# Altium schematic sheet main.SchDoc
size 420 x 297 mm; SheetNumber: 1; SheetTotal: 1
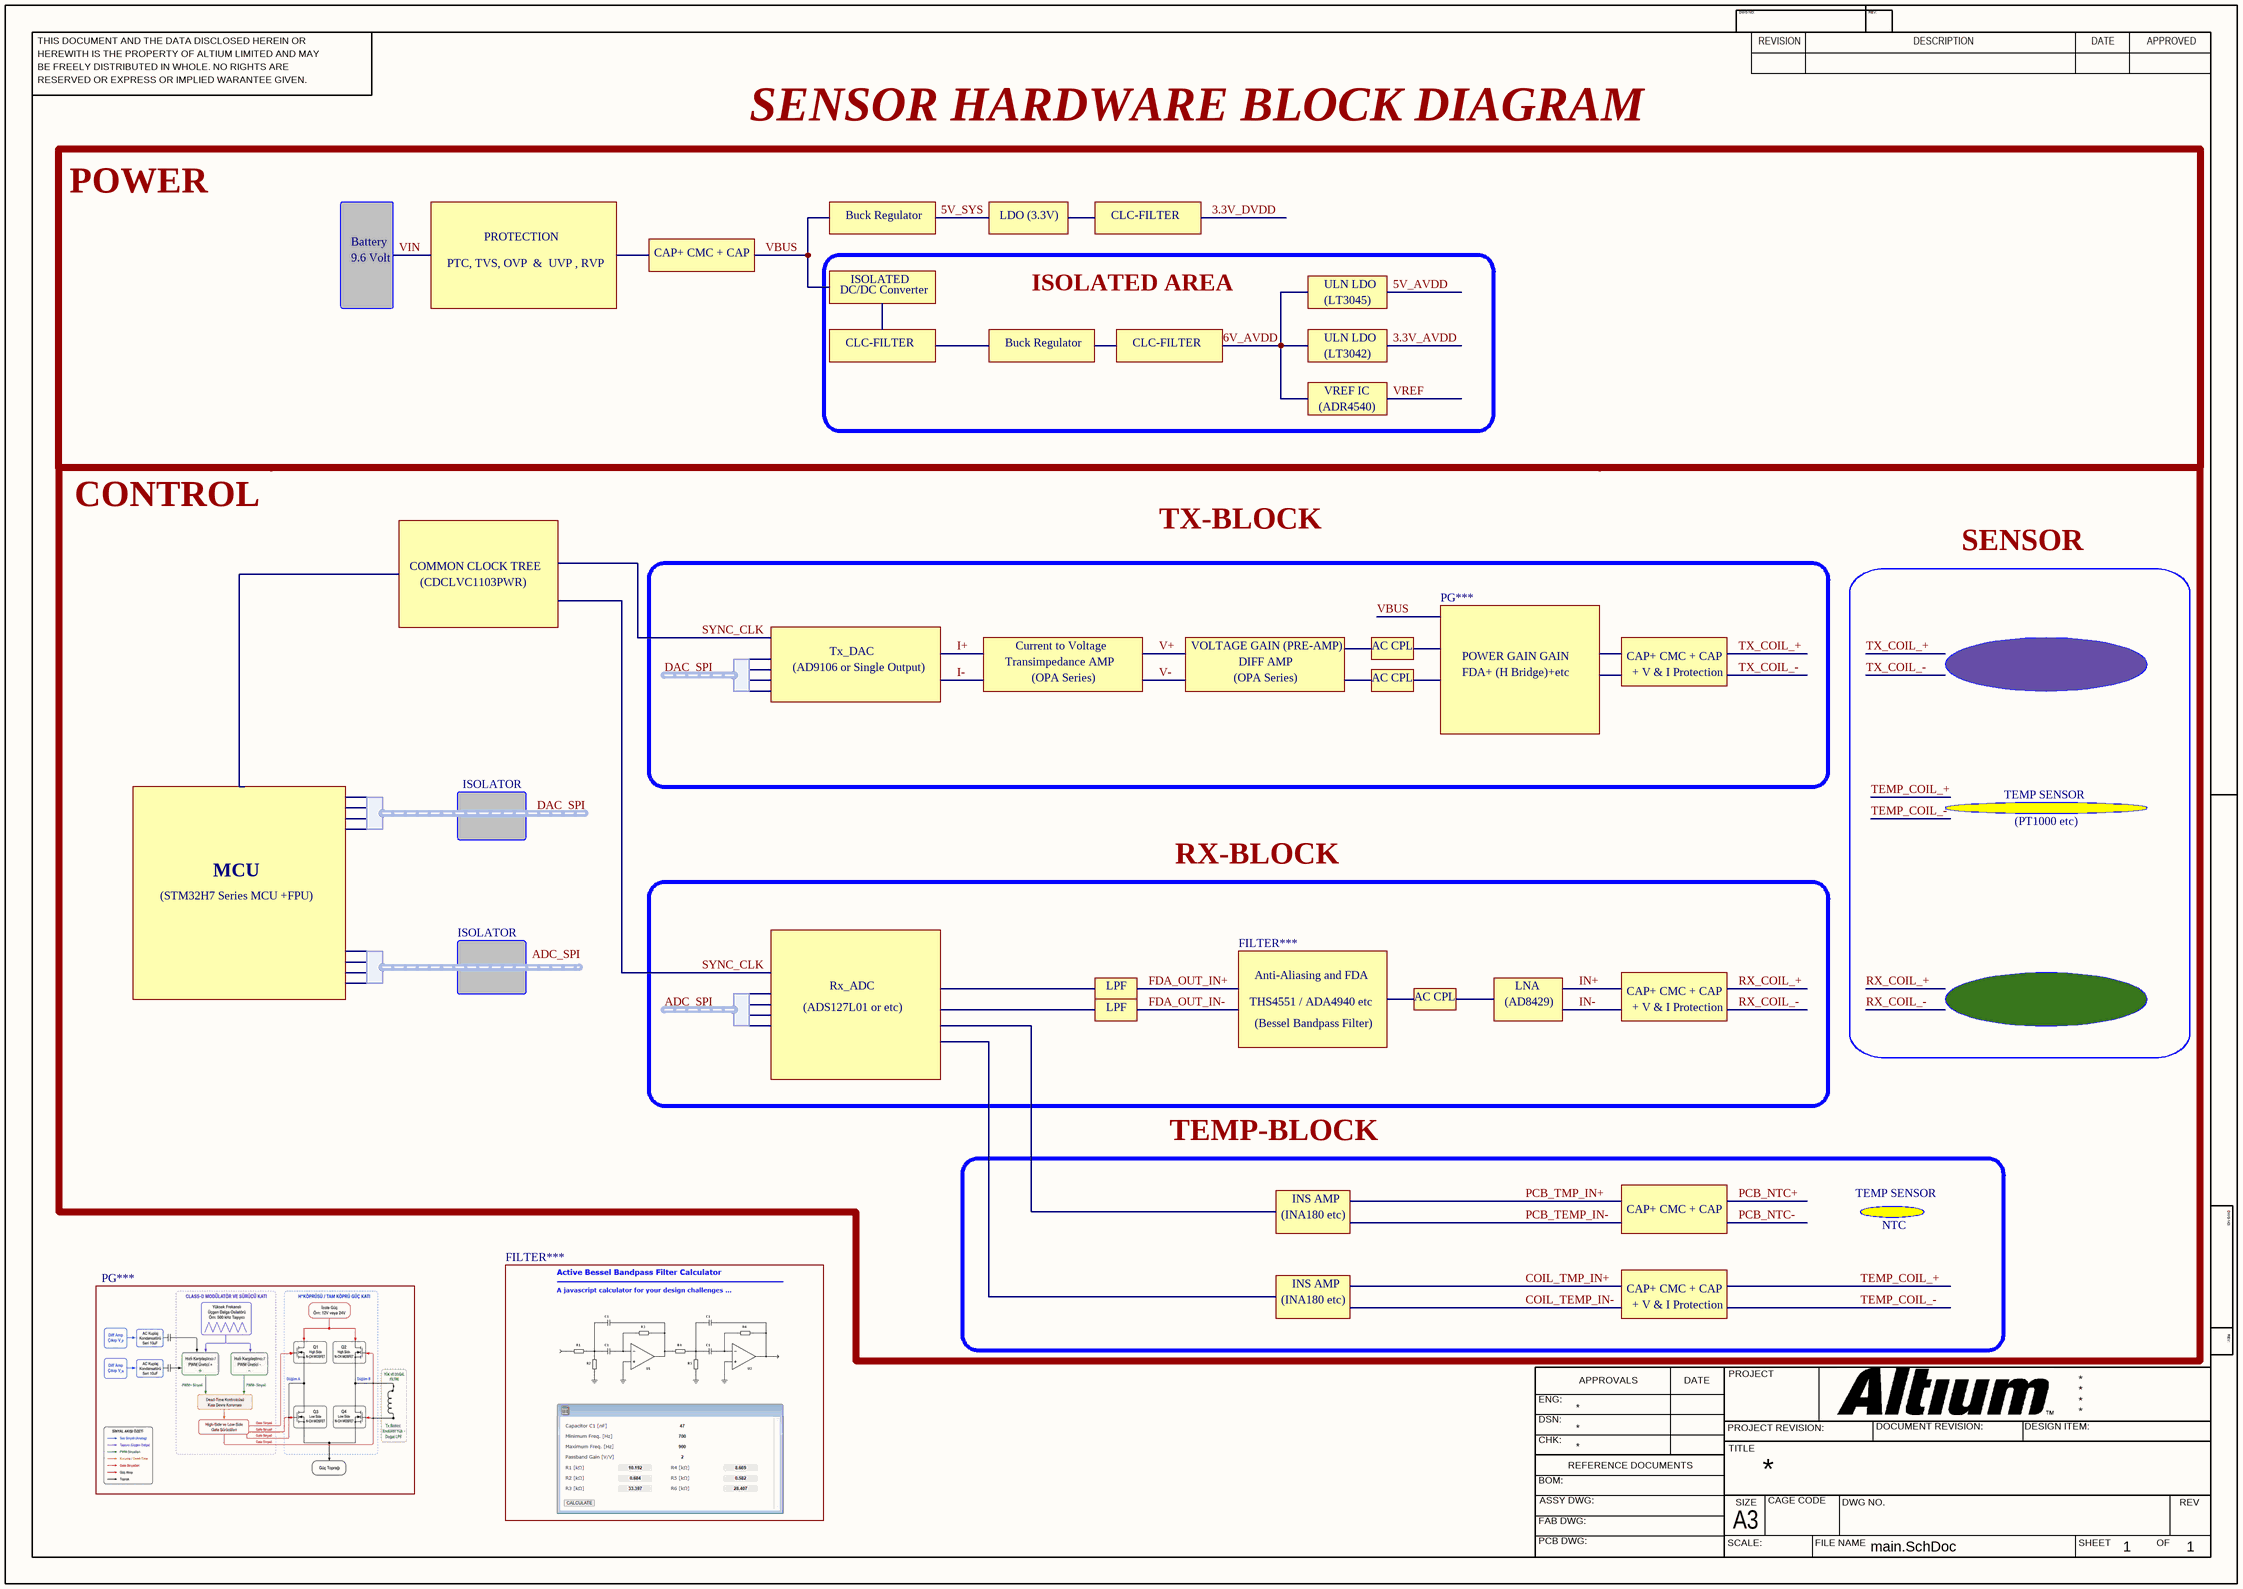
[diagram p0: main.SchDoc]

## Harnesses
*: 

## Notes on the sheet
- SENSOR HARDWARE BLOCK DIAGRAM
- POWER
- Battery
- 9.6 Volt
- PROTECTION
- CAP+ CMC + CAP
- Buck Regulator
- LDO (3.3V)
- CLC-FILTER
- PTC, TVS, OVP  &  UVP , RVP
- DC/DC Converter
- ISOLATED
- ISOLATED AREA
- ULN LDO
- (LT3045)
- (LT3042)
- VREF IC
- (ADR4540)
- CONTROL
- TX-BLOCK
- COMMON CLOCK TREE
- (CDCLVC1103PWR)
- SENSOR
- Tx_DAC
- Transimpedance AMP
- Current to Voltage
- VOLTAGE GAIN (PRE-AMP)
- DIFF AMP
- AC CPL
- PG***
- POWER GAIN GAIN
- (AD9106 or Single Output)
- (OPA Series)
- FDA+ (H Bridge)+etc
- + V & I Protection
- ISOLATOR
- TEMP SENSOR
- RX-BLOCK
- (PT1000 etc)
- (STM32H7 Series MCU +FPU)
- MCU
- Rx_ADC
- LPF
- FILTER***
- THS4551 / ADA4940 etc
- Anti-Aliasing and FDA
- (AD8429)
- LNA
- (ADS127L01 or etc)
- (Bessel Bandpass Filter)
- TEMP-BLOCK
- INS AMP
- (INA180 etc)
- NTC
- Labels drawn without touching a wire or pin: ADC_SPI
- THIS DOCUMENT AND THE DATA DISCLOSED HEREIN OR
- HEREWITH IS THE PROPERTY OF ALTIUM LIMITED AND MAY
- DWG NO:
- REVISION
- REV:
- DESCRIPTION
- DATE
- APPROVED
- BE FREELY DISTRIBUTED IN WHOLE. NO RIGHTS ARE
- RESERVED OR EXPRESS OR IMPLIED WARANTEE GIVEN.
- ENG:
- APPROVALS
- PROJECT
- DSN:
- CHK:
- REFERENCE DOCUMENTS
- PROJECT REVISION:
- TITLE
- DOCUMENT REVISION:
- DESIGN ITEM:
- BOM:
- FAB DWG:
- PCB DWG:
- ASSY DWG:
- SCALE:
- A3
- SIZE
- CAGE CODE
- FILE NAME
- DWG NO.
- SHEET
- OF
- REV